# EAGLE design CAN Traffic Teensy 4.1 rev1 (EAGLE 9.6.2)
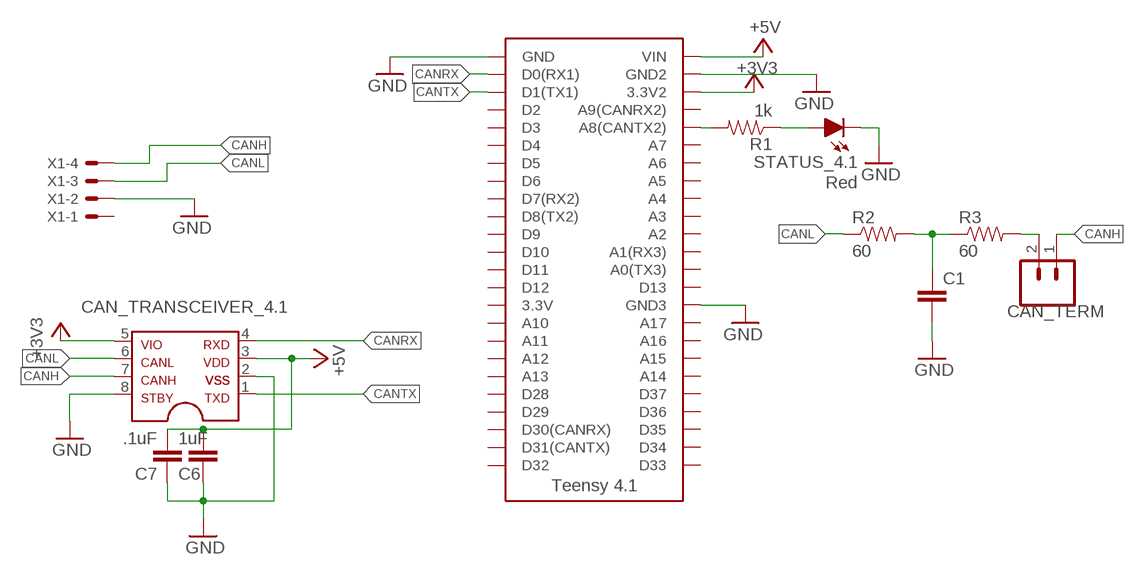
[diagram p0: schematic, sheet 1]

## Parts
4.1  TEENSY_4.1_SIMPLE  [TEENSY_4.1_SIMPLE]
C1  CAP0603-CAP  [0603-CAP]
C6  1uF  CAP0603-CAP  [0603-CAP]
C7  .1uF  CAP0603-CAP  [0603-CAP]
CAN_TERM  M02_SLIM  [1X02_SLIM]
CAN_TRANSCEIVER_4.1  MCP2562SOIC-08  [SOIC-08]
R1  1k  RESISTOR0603  [0603-RES]
R2  60  RESISTOR0603-RES  [0603-RES]
R3  60  RESISTOR0603-RES  [0603-RES]
STATUS_4.1  Red  LED-0603  [LED-603]
X1  CONNECTOR-4NANO-FIT_RIGHT_ANGLE-4-SURFACE  [NANO-FIT_RIGHT_ANGLE-4-SURFACE]

## Nets
+3V3: 4.1.3.3V2 CAN_TRANSCEIVER_4.1.5
+5V: 4.1.VIN C6.1 C7.1 CAN_TRANSCEIVER_4.1.3
CANH: CAN_TERM.1 CAN_TRANSCEIVER_4.1.7 X1.4
CANL: CAN_TRANSCEIVER_4.1.6 R2.1 X1.3
CANRX: 4.1.D0(RX1) CAN_TRANSCEIVER_4.1.4
CANTX: 4.1.D1(TX1) CAN_TRANSCEIVER_4.1.1
GND: 4.1.GND 4.1.GND2 4.1.GND3 C1.2 C6.2 C7.2 CAN_TRANSCEIVER_4.1.2 STATUS_4.1.C X1.2
N$1: 4.1.A8(CANTX2) R1.2
N$2: R1.1 STATUS_4.1.A
N$3: C1.1 R2.2 R3.1
N$5: CAN_TRANSCEIVER_4.1.8 ; supply symbol labelled GND
N$6: CAN_TERM.2 R3.2
Unconnected: 4.1.3.3V 4.1.A0(TX3) 4.1.A1(RX3) 4.1.A2 4.1.A3 4.1.A4 4.1.A5 4.1.A6 4.1.A7 4.1.A9(CANRX2) 4.1.A10 4.1.A11 4.1.A12 4.1.A13 4.1.A14 4.1.A15 4.1.A16 4.1.A17 4.1.D2 4.1.D3 4.1.D4 4.1.D5 4.1.D6 4.1.D7(RX2) 4.1.D8(TX2) 4.1.D9 4.1.D10 4.1.D11 4.1.D12 4.1.D13 4.1.D28 4.1.D29 4.1.D30(CANRX) 4.1.D31(CANTX) 4.1.D32 4.1.D33 4.1.D34 4.1.D35 4.1.D36 4.1.D37 X1.1

## Library data of the parts
4.1 = HyTechDevices:TEENSY_4.1_SIMPLE: Simple version of the Teensy 4.1 board that only uses the 2 main rows of pins, with no perpendicular row with VBat or inner pins.
C1 C6 C7 = HyTechDevices:CAP: Capacitor Standard 0603 ceramic capacitor, and 0.1" leaded capacitor.
CAN_TERM = HyTechDevices:M02: Standard 2-pin 0.1" header. NOTES ON THE VARIANTS LOCK and LOCK_LONGPADS... This footprint was designed to help hold the alignment of a through-hole component (i.e. 6-pin header) while soldering it into place. You may notice that each hole has been shifted either up or down by 0.005 of an inch from it's more standard position (which is a perfectly straight line). This slight alteration caused the pins (the squares in the middle) to touch the edges of the holes. Because they are alternating, it causes a "brace" to hold the component in place. 0.005 has proven to be the perfect amount of "off-center" position when using our standard breakaway headers. Although looks a little odd when you look at the bare footprint, once you have a header in there, the alteration is very hard to notice. Also,if you push a header all the way into place, it is covered up entirely on the bottom side. This idea of altering the position of holes to aid alignment will be further integrated into the Sparkfun Library for other footprints. It can help hold any component with 3 or more connection pins. Note: The Sparkfun version includes many other packages including surface mount that may be of future interest. Source: Sparkfun <https://github.com/sparkfun/SparkFun-Eagle-Libraries>
CAN_TRANSCEIVER_4.1 = HyTechDevices:MCP2562: MCP2562 High-speed CAN Transceiver Datatsheet <http://ww1.microchip.com/downloads/en/devicedoc/20005167c.pdf>
R1-R3 = HyTechDevices:RESISTOR: Resistor Basic schematic elements and footprints for 0603, 1206, and PTH resistors.
STATUS_4.1 = HyTechDevices:LED: Light Emitting Diode (LED) Source: Dangerous Prototypes Eagle Library <https://github.com/DangerousPrototypes/Eagle_Part_Library>
X1 = HyTechDevices:CONNECTOR-4: Mini-Fit Junior connector 4 pole Source: http://www.molex.com

## Board
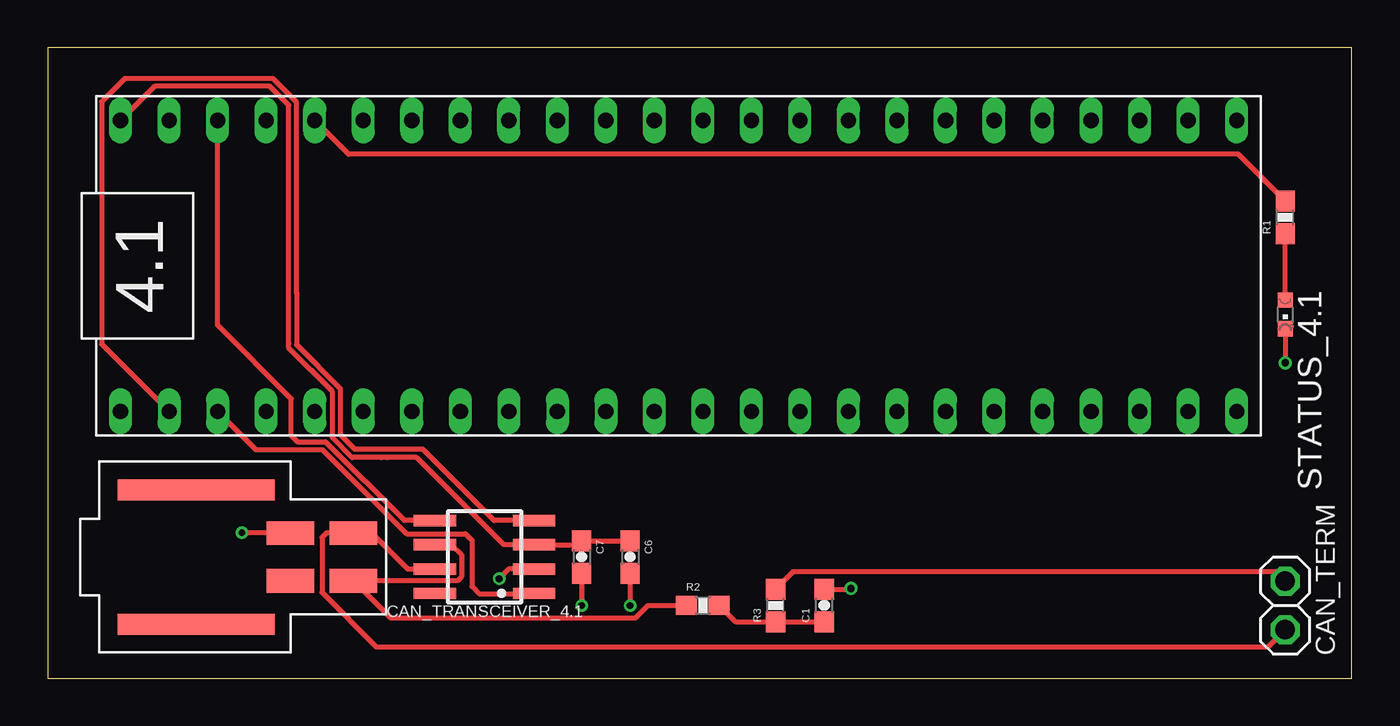
[diagram p1: board, top side]
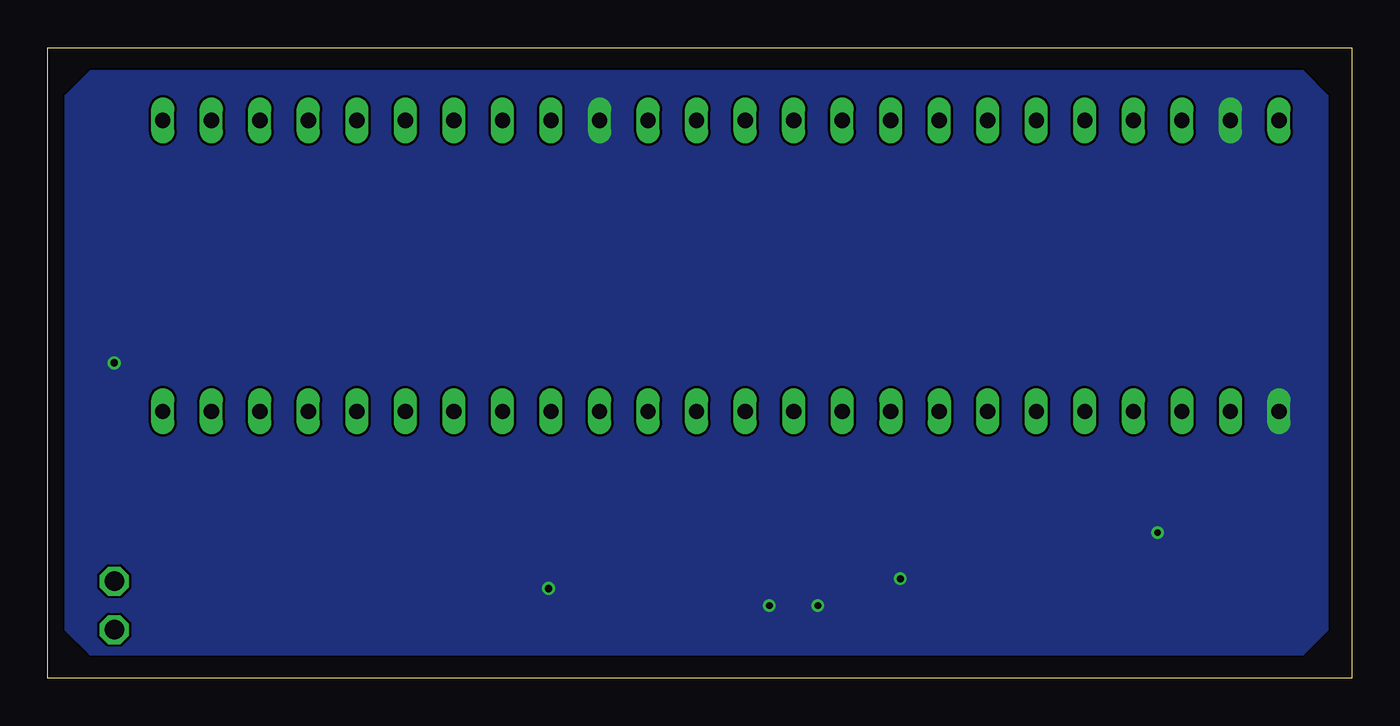
[diagram p2: board, bottom side, seen from below]

Size 68.25 x 33.01 mm. Coordinates in mm from the lower left corner, seen from the top.
Outline: 0,0 68.25,0 68.25,33.01 0,33.01 0,0
Copper layers (1*16): Top 0.035mm / dielectric 1.53mm / Bottom 0.035mm
Design rules "JLCPCB (2 Layer)": minimum track width 5mil, minimum drill 0.3mm, track to track 5mil, track to pad 5mil, pad to pad 5mil, via to via 20mil, smd to smd 5mil, copper to edge 0.2mm, drill to drill 21mil, minimum pad ring 6mil, minimum via ring 6mil, stop-mask expansion 6mil, vias tented up to drill 30mil, thermal gap 10mil

### Footprints (pad centres in the part's own frame; a part is rotated, then mirrored left to right if it is on the bottom)
TEENSY_4.1_SIMPLE = drill 0.8 long: 3.3V 1.27,24.13; 3.3V2 16.51,54.61; A0(TX3) 16.51,29.21; A1(RX3) 16.51,31.75; A2 16.51,34.29; A3 16.51,36.83; A4 16.51,39.37; A5 16.51,41.91; A6 16.51,44.45; A7 16.51,46.99; A8(CANTX2) 16.51,49.53; A9(CANRX2) 16.51,52.07; A10 1.27,21.59; A11 1.27,19.05; A12 1.27,16.51; A13 1.27,13.97; A14 16.51,13.97; A15 16.51,16.51; A16 16.51,19.05; A17 16.51,21.59; D0(RX1) 1.27,57.15; D1(TX1) 1.27,54.61; D2 1.27,52.07; D3 1.27,49.53; D4 1.27,46.99; D5 1.27,44.45; D6 1.27,41.91; D7(RX2) 1.27,39.37; D8(TX2) 1.27,36.83; D9 1.27,34.29; D10 1.27,31.75; D11 1.27,29.21; D12 1.27,26.67; D13 16.51,26.67; D28 1.27,11.43; D29 1.27,8.89; D30(CANRX) 1.27,6.35; D31(CANTX) 1.27,3.81; D32 1.27,1.27; D33 16.51,1.27; D34 16.51,3.81; D35 16.51,6.35; D36 16.51,8.89; D37 16.51,11.43; GND 1.27,59.69; GND2 16.51,57.15; GND3 16.51,24.13; VIN 16.51,59.69
0603-CAP = smd 1.1 x 1: 1 -0.85,0; 2 0.85,0
1X02_SLIM = drill 1.016 octagon: 1 -1.27,0; 2 1.27,0
SOIC-08 = smd 0.6 x 2.2: 1 -1.905,-2.6; 2 -0.635,-2.6; 3 0.635,-2.6; 4 1.905,-2.6; 5 1.905,2.6; 6 0.635,2.6; 7 -0.635,2.6; 8 -1.905,2.6
0603-RES = smd 1.1 x 1: 1 -0.85,0; 2 0.85,0
LED-603 = smd 0.8 x 0.8: A 0,-0.75; C 0,0.75
NANO-FIT_RIGHT_ANGLE-4-SURFACE = smd 1.24 x 2.5: 1 1.25,0; 2 -1.25,0; 3 1.25,3.3; 4 -1.25,3.3 | smd 1.1 x 8.2: P$5 -3.52,-4.93; P$6 3.52,-4.93

### Placement (x,y rotation side)
4.1  63.5,12.7 90 top
C1  40.64,3.81 90 top
C6  30.48,6.35 270 top
C7  27.94,6.35 270 top
CAN_TERM  64.77,3.81 90 top
CAN_TRANSCEIVER_4.1  22.86,6.35 90 top
R1  64.77,24.13 90 top
R2  34.29,3.81 0 top
R3  38.1,3.81 90 top
STATUS_4.1  64.77,19.05 180 top
X1  12.7,6.35 270 top

### Tracks (layer width: path | path; a pad name or v marks a point on that pad's centre or on a via)
+3V3
  Top 0.254: CAN_TRANSCEIVER_4.1.5 18.67,8.26 14.54,12.38 13.07,12.38 12.74,12.71 12.74,14.63 8.89,18.48 4.1.3.3V2
+5V
  Top 0.254: C6.1 C7.1 27.73,6.99 CAN_TRANSCEIVER_4.1.3 23.88,6.99 19.3,11.56 17.78,11.56 17.46,11.56 15.94,11.56 14.9,12.6 14.9,15.01 12.62,17.3 12.62,17.53 12.62,30 11.63,30.99 5.59,30.99 4.1.VIN
CANH
  Top 0.254: CAN_TRANSCEIVER_4.1.7 18.85,5.71 16.96,7.6 X1.4 14.59,7.6 14.35,7.37 14.35,4.48 17.21,1.62 63.85,1.62 CAN_TERM.1
CANL
  Top 0.254: CAN_TRANSCEIVER_4.1.6 21.15,6.99 21.66,6.48 21.66,5.32 21.44,5.1 X1.3 17.95,3.15 30.75,3.15 31.41,3.81 R2.1
CANRX
  Top 0.254: CAN_TRANSCEIVER_4.1.4 23.37,8.26 19.62,12 16.07,12 15.31,12.76 15.31,15.18 13.02,17.46 13.02,20.19 13.02,20.32 13.02,30.16 11.79,31.39 4.02,31.39 2.82,30.2 2.82,17.5 4.1.D0(RX1)
CANTX
  Top 0.254: CAN_TRANSCEIVER_4.1.1 25.44,4.42 22.59,4.42 22.2,4.81 22.2,7.22 21.86,7.56 18.79,7.56 14.37,11.98 10.88,11.98 9.42,13.43 9.42,13.44 4.1.D1(TX1)
GND  (via drill 0.35, 0.38)
  Top 0.254: X1.2 10.18,7.6 v10.16,7.62 | C7.2 v27.94,3.81 | C6.2 v30.48,3.81 | v23.62,5.21 24.13,5.71 CAN_TRANSCEIVER_4.1.2 | STATUS_4.1.C v64.77,16.51 | C1.2 42,4.66 v42.04,4.7
  pour Bottom (no thermals): 2.54,31.75 66.04,31.75 67.31,30.48 67.31,2.54 66.04,1.27 2.54,1.27 1.27,2.54 1.27,30.48
N$1
  Top 0.254: R1.2 62.32,27.43 15.75,27.43 4.1.A8(CANTX2)
N$2
  Top 0.254: STATUS_4.1.A R1.1
N$3
  Top 0.254: R2.2 35.99,2.96 R3.1 C1.1
N$6
  Top 0.254: CAN_TERM.2 64.26,5.59 39.03,5.59 R3.2

### Text on the board
tDocu: TEENSY 4.1